# Altium schematic sheet MCH_FPGA_Bank_47_48_67_HP_VHDCI.SchDoc: Metlino
size 420 x 297 mm; CheckedBy: P.Kulik,T.Przywozki,W.Ruclo; Author: G.Kasprowicz; CompanyName: WUT ISE; DrawnBy: G.Kasprowicz; Organization: WUT ISE; Address1: PW ISE; Address2: Nowowiejska 15/19 00-665 Warsaw; Address3: gkasprow@gmail.com; DocumentNumber: 7; Revision: 2; SheetNumber: 7; SheetTotal: 29; ModifiedBy: -; CheckedDate: -; Title2: FPGA banks - VHDCI; DivGrp: WUT ISE; Designer: G.Kasprowicz; ModifiedDate: -; ProjectName: Sensor Box
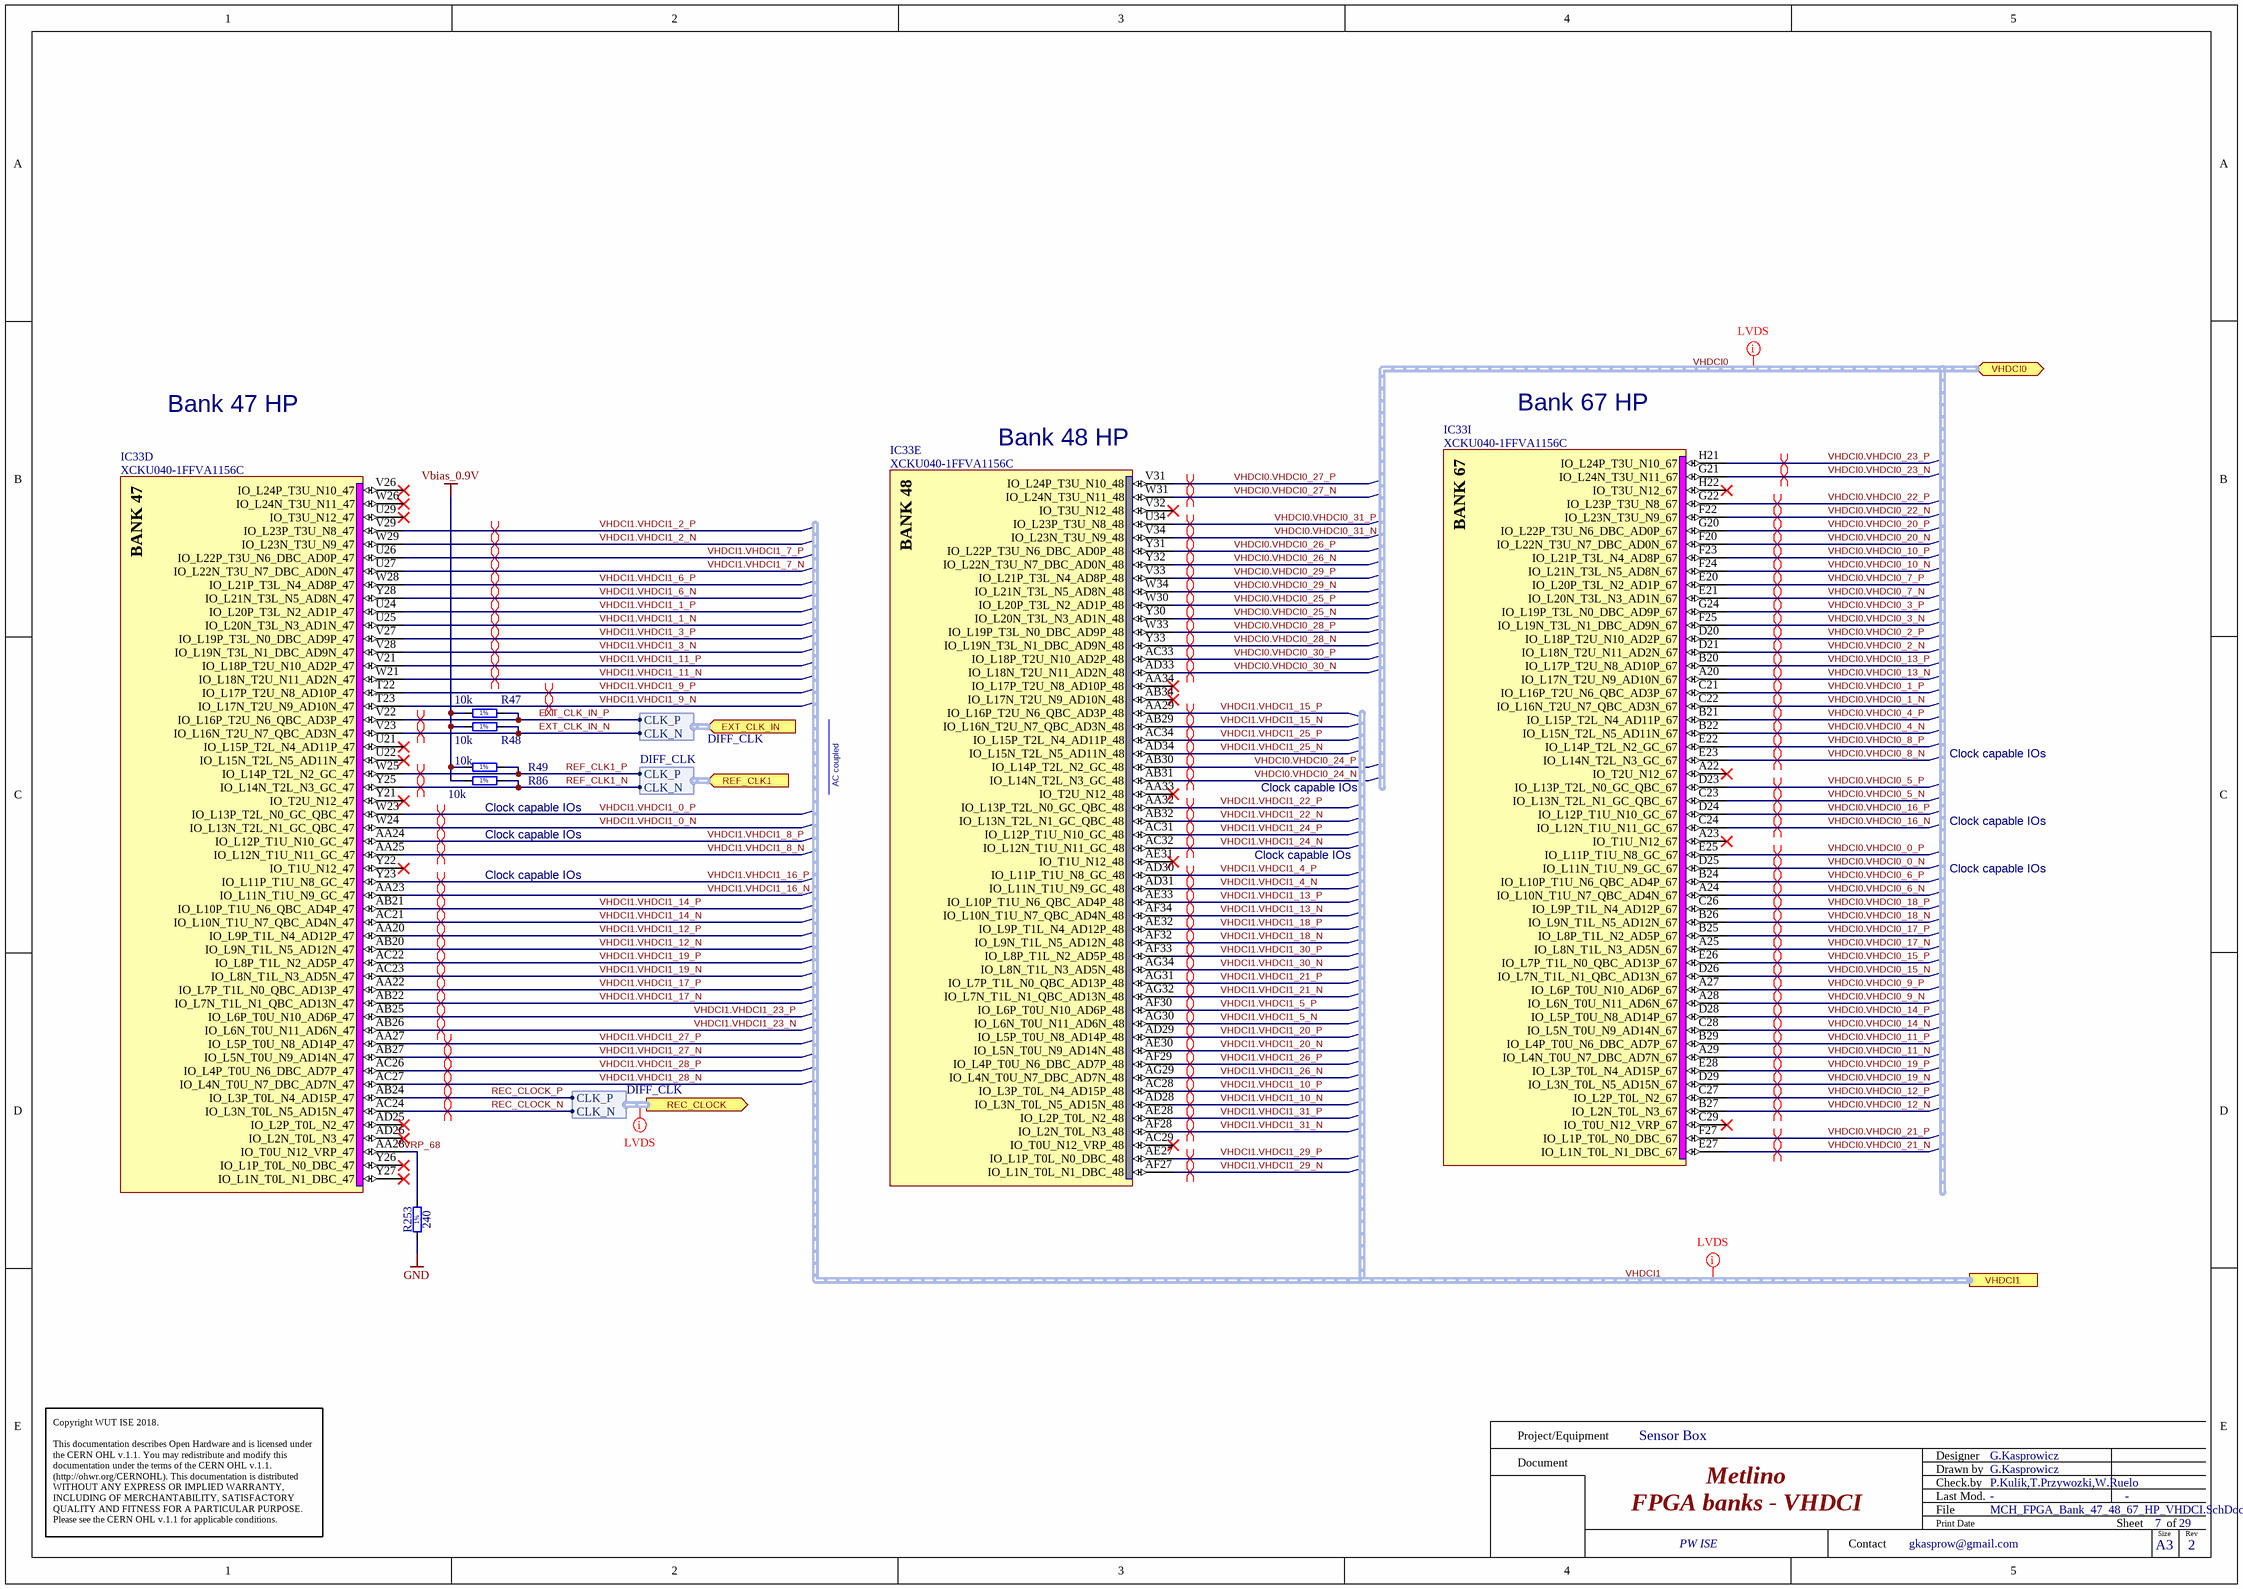
[diagram p0: MCH_FPGA_Bank_47_48_67_HP_VHDCI.SchDoc]

## Parts
IC33  XCKU040-1FFVA1156C  [BGA1156C100P34X34_3500X3500X350]  (parts D,E,I of 22)
R47  10k  [RESC1005X40N]
R48  10k  [RESC1005X40N]
R49  10k  [RESC1005X40N]
R86  10k  [RESC1005X40N]
R253  240  [RESC1005X40N]

## Ports
EXT_CLK_IN (in, harness DIFF_CLK), REC_CLOCK (out, harness DIFF_CLK), REF_CLK1 (in, harness DIFF_CLK), VHDCI0 (bidir, harness VHDCI0), VHDCI1 (harness VHDCI1)

## Harnesses
DIFF_CLK: CLK_N, CLK_P

## Nets
GND: R253.1
Vbias_0.9V: R47.1 R48.1 R49.1 R86.1
EXT_CLK_IN_N: IC33.V23(IO_L16N_T2U_N7_QBC_AD3N_47) R48.2 ; port EXT_CLK_IN.CLK_N
EXT_CLK_IN_P: IC33.V22(IO_L16P_T2U_N6_QBC_AD3P_47) R47.2 ; port EXT_CLK_IN.CLK_P
REC_CLOCK_N: IC33.AC24(IO_L3N_T0L_N5_AD15N_47) ; port REC_CLOCK.CLK_N
REC_CLOCK_P: IC33.AB24(IO_L3P_T0L_N4_AD15P_47) ; port REC_CLOCK.CLK_P
REF_CLK1_N: IC33.Y25(IO_L14N_T2L_N3_GC_47) R86.2 ; port REF_CLK1.CLK_N
REF_CLK1_P: IC33.W25(IO_L14P_T2L_N2_GC_47) R49.2 ; port REF_CLK1.CLK_P
VHDCI0.VHDCI0_0_N: IC33.D25(IO_L11N_T1U_N9_GC_67)
VHDCI0.VHDCI0_0_P: IC33.E25(IO_L11P_T1U_N8_GC_67)
VHDCI0.VHDCI0_1_N: IC33.C22(IO_L16N_T2U_N7_QBC_AD3N_67)
VHDCI0.VHDCI0_1_P: IC33.C21(IO_L16P_T2U_N6_QBC_AD3P_67)
VHDCI0.VHDCI0_2_N: IC33.D21(IO_L18N_T2U_N11_AD2N_67)
VHDCI0.VHDCI0_2_P: IC33.D20(IO_L18P_T2U_N10_AD2P_67)
VHDCI0.VHDCI0_3_N: IC33.F25(IO_L19N_T3L_N1_DBC_AD9N_67)
VHDCI0.VHDCI0_3_P: IC33.G24(IO_L19P_T3L_N0_DBC_AD9P_67)
VHDCI0.VHDCI0_4_N: IC33.B22(IO_L15N_T2L_N5_AD11N_67)
VHDCI0.VHDCI0_4_P: IC33.B21(IO_L15P_T2L_N4_AD11P_67)
VHDCI0.VHDCI0_5_N: IC33.C23(IO_L13N_T2L_N1_GC_QBC_67)
VHDCI0.VHDCI0_5_P: IC33.D23(IO_L13P_T2L_N0_GC_QBC_67)
VHDCI0.VHDCI0_6_N: IC33.A24(IO_L10N_T1U_N7_QBC_AD4N_67)
VHDCI0.VHDCI0_6_P: IC33.B24(IO_L10P_T1U_N6_QBC_AD4P_67)
VHDCI0.VHDCI0_7_N: IC33.E21(IO_L20N_T3L_N3_AD1N_67)
VHDCI0.VHDCI0_7_P: IC33.E20(IO_L20P_T3L_N2_AD1P_67)
VHDCI0.VHDCI0_8_N: IC33.E23(IO_L14N_T2L_N3_GC_67)
VHDCI0.VHDCI0_8_P: IC33.E22(IO_L14P_T2L_N2_GC_67)
VHDCI0.VHDCI0_9_N: IC33.A28(IO_L6N_T0U_N11_AD6N_67)
VHDCI0.VHDCI0_9_P: IC33.A27(IO_L6P_T0U_N10_AD6P_67)
VHDCI0.VHDCI0_10_N: IC33.F24(IO_L21N_T3L_N5_AD8N_67)
VHDCI0.VHDCI0_10_P: IC33.F23(IO_L21P_T3L_N4_AD8P_67)
VHDCI0.VHDCI0_11_N: IC33.A29(IO_L4N_T0U_N7_DBC_AD7N_67)
VHDCI0.VHDCI0_11_P: IC33.B29(IO_L4P_T0U_N6_DBC_AD7P_67)
VHDCI0.VHDCI0_12_N: IC33.B27(IO_L2N_T0L_N3_67)
VHDCI0.VHDCI0_12_P: IC33.C27(IO_L2P_T0L_N2_67)
VHDCI0.VHDCI0_13_N: IC33.A20(IO_L17N_T2U_N9_AD10N_67)
VHDCI0.VHDCI0_13_P: IC33.B20(IO_L17P_T2U_N8_AD10P_67)
VHDCI0.VHDCI0_14_N: IC33.C28(IO_L5N_T0U_N9_AD14N_67)
VHDCI0.VHDCI0_14_P: IC33.D28(IO_L5P_T0U_N8_AD14P_67)
VHDCI0.VHDCI0_15_N: IC33.D26(IO_L7N_T1L_N1_QBC_AD13N_67)
VHDCI0.VHDCI0_15_P: IC33.E26(IO_L7P_T1L_N0_QBC_AD13P_67)
VHDCI0.VHDCI0_16_N: IC33.C24(IO_L12N_T1U_N11_GC_67)
VHDCI0.VHDCI0_16_P: IC33.D24(IO_L12P_T1U_N10_GC_67)
VHDCI0.VHDCI0_17_N: IC33.A25(IO_L8N_T1L_N3_AD5N_67)
VHDCI0.VHDCI0_17_P: IC33.B25(IO_L8P_T1L_N2_AD5P_67)
VHDCI0.VHDCI0_18_N: IC33.B26(IO_L9N_T1L_N5_AD12N_67)
VHDCI0.VHDCI0_18_P: IC33.C26(IO_L9P_T1L_N4_AD12P_67)
VHDCI0.VHDCI0_19_N: IC33.D29(IO_L3N_T0L_N5_AD15N_67)
VHDCI0.VHDCI0_19_P: IC33.E28(IO_L3P_T0L_N4_AD15P_67)
VHDCI0.VHDCI0_20_N: IC33.F20(IO_L22N_T3U_N7_DBC_AD0N_67)
VHDCI0.VHDCI0_20_P: IC33.G20(IO_L22P_T3U_N6_DBC_AD0P_67)
VHDCI0.VHDCI0_21_N: IC33.E27(IO_L1N_T0L_N1_DBC_67)
VHDCI0.VHDCI0_21_P: IC33.F27(IO_L1P_T0L_N0_DBC_67)
VHDCI0.VHDCI0_22_N: IC33.F22(IO_L23N_T3U_N9_67)
VHDCI0.VHDCI0_22_P: IC33.G22(IO_L23P_T3U_N8_67)
VHDCI0.VHDCI0_23_N: IC33.G21(IO_L24N_T3U_N11_67)
VHDCI0.VHDCI0_23_P: IC33.H21(IO_L24P_T3U_N10_67)
VHDCI0.VHDCI0_24_N: IC33.AB31(IO_L14N_T2L_N3_GC_48)
VHDCI0.VHDCI0_24_P: IC33.AB30(IO_L14P_T2L_N2_GC_48)
VHDCI0.VHDCI0_25_N: IC33.Y30(IO_L20N_T3L_N3_AD1N_48)
VHDCI0.VHDCI0_25_P: IC33.W30(IO_L20P_T3L_N2_AD1P_48)
VHDCI0.VHDCI0_26_N: IC33.Y32(IO_L22N_T3U_N7_DBC_AD0N_48)
VHDCI0.VHDCI0_26_P: IC33.Y31(IO_L22P_T3U_N6_DBC_AD0P_48)
VHDCI0.VHDCI0_27_N: IC33.W31(IO_L24N_T3U_N11_48)
VHDCI0.VHDCI0_27_P: IC33.V31(IO_L24P_T3U_N10_48)
VHDCI0.VHDCI0_28_N: IC33.Y33(IO_L19N_T3L_N1_DBC_AD9N_48)
VHDCI0.VHDCI0_28_P: IC33.W33(IO_L19P_T3L_N0_DBC_AD9P_48)
VHDCI0.VHDCI0_29_N: IC33.W34(IO_L21N_T3L_N5_AD8N_48)
VHDCI0.VHDCI0_29_P: IC33.V33(IO_L21P_T3L_N4_AD8P_48)
VHDCI0.VHDCI0_30_N: IC33.AD33(IO_L18N_T2U_N11_AD2N_48)
VHDCI0.VHDCI0_30_P: IC33.AC33(IO_L18P_T2U_N10_AD2P_48)
VHDCI0.VHDCI0_31_N: IC33.V34(IO_L23N_T3U_N9_48)
VHDCI0.VHDCI0_31_P: IC33.U34(IO_L23P_T3U_N8_48)
VHDCI1.VHDCI1_0_N: IC33.W24(IO_L13N_T2L_N1_GC_QBC_47)
VHDCI1.VHDCI1_0_P: IC33.W23(IO_L13P_T2L_N0_GC_QBC_47)
VHDCI1.VHDCI1_1_N: IC33.U25(IO_L20N_T3L_N3_AD1N_47)
VHDCI1.VHDCI1_1_P: IC33.U24(IO_L20P_T3L_N2_AD1P_47)
VHDCI1.VHDCI1_2_N: IC33.W29(IO_L23N_T3U_N9_47)
VHDCI1.VHDCI1_2_P: IC33.V29(IO_L23P_T3U_N8_47)
VHDCI1.VHDCI1_3_N: IC33.V28(IO_L19N_T3L_N1_DBC_AD9N_47)
VHDCI1.VHDCI1_3_P: IC33.V27(IO_L19P_T3L_N0_DBC_AD9P_47)
VHDCI1.VHDCI1_4_N: IC33.AD31(IO_L11N_T1U_N9_GC_48)
VHDCI1.VHDCI1_4_P: IC33.AD30(IO_L11P_T1U_N8_GC_48)
VHDCI1.VHDCI1_5_N: IC33.AG30(IO_L6N_T0U_N11_AD6N_48)
VHDCI1.VHDCI1_5_P: IC33.AF30(IO_L6P_T0U_N10_AD6P_48)
VHDCI1.VHDCI1_6_N: IC33.Y28(IO_L21N_T3L_N5_AD8N_47)
VHDCI1.VHDCI1_6_P: IC33.W28(IO_L21P_T3L_N4_AD8P_47)
VHDCI1.VHDCI1_7_N: IC33.U27(IO_L22N_T3U_N7_DBC_AD0N_47)
VHDCI1.VHDCI1_7_P: IC33.U26(IO_L22P_T3U_N6_DBC_AD0P_47)
VHDCI1.VHDCI1_8_N: IC33.AA25(IO_L12N_T1U_N11_GC_47)
VHDCI1.VHDCI1_8_P: IC33.AA24(IO_L12P_T1U_N10_GC_47)
VHDCI1.VHDCI1_9_N: IC33.T23(IO_L17N_T2U_N9_AD10N_47)
VHDCI1.VHDCI1_9_P: IC33.T22(IO_L17P_T2U_N8_AD10P_47)
VHDCI1.VHDCI1_10_N: IC33.AD28(IO_L3N_T0L_N5_AD15N_48)
VHDCI1.VHDCI1_10_P: IC33.AC28(IO_L3P_T0L_N4_AD15P_48)
VHDCI1.VHDCI1_11_N: IC33.W21(IO_L18N_T2U_N11_AD2N_47)
VHDCI1.VHDCI1_11_P: IC33.V21(IO_L18P_T2U_N10_AD2P_47)
VHDCI1.VHDCI1_12_N: IC33.AB20(IO_L9N_T1L_N5_AD12N_47)
VHDCI1.VHDCI1_12_P: IC33.AA20(IO_L9P_T1L_N4_AD12P_47)
VHDCI1.VHDCI1_13_N: IC33.AF34(IO_L10N_T1U_N7_QBC_AD4N_48)
VHDCI1.VHDCI1_13_P: IC33.AE33(IO_L10P_T1U_N6_QBC_AD4P_48)
VHDCI1.VHDCI1_14_N: IC33.AC21(IO_L10N_T1U_N7_QBC_AD4N_47)
VHDCI1.VHDCI1_14_P: IC33.AB21(IO_L10P_T1U_N6_QBC_AD4P_47)
VHDCI1.VHDCI1_15_N: IC33.AB29(IO_L16N_T2U_N7_QBC_AD3N_48)
VHDCI1.VHDCI1_15_P: IC33.AA29(IO_L16P_T2U_N6_QBC_AD3P_48)
VHDCI1.VHDCI1_16_N: IC33.AA23(IO_L11N_T1U_N9_GC_47)
VHDCI1.VHDCI1_16_P: IC33.Y23(IO_L11P_T1U_N8_GC_47)
VHDCI1.VHDCI1_17_N: IC33.AB22(IO_L7N_T1L_N1_QBC_AD13N_47)
VHDCI1.VHDCI1_17_P: IC33.AA22(IO_L7P_T1L_N0_QBC_AD13P_47)
VHDCI1.VHDCI1_18_N: IC33.AF32(IO_L9N_T1L_N5_AD12N_48)
VHDCI1.VHDCI1_18_P: IC33.AE32(IO_L9P_T1L_N4_AD12P_48)
VHDCI1.VHDCI1_19_N: IC33.AC23(IO_L8N_T1L_N3_AD5N_47)
VHDCI1.VHDCI1_19_P: IC33.AC22(IO_L8P_T1L_N2_AD5P_47)
VHDCI1.VHDCI1_20_N: IC33.AE30(IO_L5N_T0U_N9_AD14N_48)
VHDCI1.VHDCI1_20_P: IC33.AD29(IO_L5P_T0U_N8_AD14P_48)
VHDCI1.VHDCI1_21_N: IC33.AG32(IO_L7N_T1L_N1_QBC_AD13N_48)
VHDCI1.VHDCI1_21_P: IC33.AG31(IO_L7P_T1L_N0_QBC_AD13P_48)
VHDCI1.VHDCI1_22_N: IC33.AB32(IO_L13N_T2L_N1_GC_QBC_48)
VHDCI1.VHDCI1_22_P: IC33.AA32(IO_L13P_T2L_N0_GC_QBC_48)
VHDCI1.VHDCI1_23_N: IC33.AB26(IO_L6N_T0U_N11_AD6N_47)
VHDCI1.VHDCI1_23_P: IC33.AB25(IO_L6P_T0U_N10_AD6P_47)
VHDCI1.VHDCI1_24_N: IC33.AC32(IO_L12N_T1U_N11_GC_48)
VHDCI1.VHDCI1_24_P: IC33.AC31(IO_L12P_T1U_N10_GC_48)
VHDCI1.VHDCI1_25_N: IC33.AD34(IO_L15N_T2L_N5_AD11N_48)
VHDCI1.VHDCI1_25_P: IC33.AC34(IO_L15P_T2L_N4_AD11P_48)
VHDCI1.VHDCI1_26_N: IC33.AG29(IO_L4N_T0U_N7_DBC_AD7N_48)
VHDCI1.VHDCI1_26_P: IC33.AF29(IO_L4P_T0U_N6_DBC_AD7P_48)
VHDCI1.VHDCI1_27_N: IC33.AB27(IO_L5N_T0U_N9_AD14N_47)
VHDCI1.VHDCI1_27_P: IC33.AA27(IO_L5P_T0U_N8_AD14P_47)
VHDCI1.VHDCI1_28_N: IC33.AC27(IO_L4N_T0U_N7_DBC_AD7N_47)
VHDCI1.VHDCI1_28_P: IC33.AC26(IO_L4P_T0U_N6_DBC_AD7P_47)
VHDCI1.VHDCI1_29_N: IC33.AF27(IO_L1N_T0L_N1_DBC_48)
VHDCI1.VHDCI1_29_P: IC33.AE27(IO_L1P_T0L_N0_DBC_48)
VHDCI1.VHDCI1_30_N: IC33.AG34(IO_L8N_T1L_N3_AD5N_48)
VHDCI1.VHDCI1_30_P: IC33.AF33(IO_L8P_T1L_N2_AD5P_48)
VHDCI1.VHDCI1_31_N: IC33.AF28(IO_L2N_T0L_N3_48)
VHDCI1.VHDCI1_31_P: IC33.AE28(IO_L2P_T0L_N2_48)
VRP_68: IC33.AA28(IO_T0U_N12_VRP_47) R253.2

Not connected (* = marked no-connect by the designer): IC33 A22(IO_T2U_N12_67)* A23(IO_T1U_N12_67)* AA33(IO_T2U_N12_48)* AA34(IO_L17P_T2U_N8_AD10P_48)* AB34(IO_L17N_T2U_N9_AD10N_48)* AC29(IO_T0U_N12_VRP_48)* AD25(IO_L2P_T0L_N2_47)* AD26(IO_L2N_T0L_N3_47)* AE31(IO_T1U_N12_48)* C29(IO_T0U_N12_VRP_67)* H22(IO_T3U_N12_67)* U21(IO_L15P_T2L_N4_AD11P_47)* U22(IO_L15N_T2L_N5_AD11N_47)* U29(IO_T3U_N12_47)* V26(IO_L24P_T3U_N10_47)* V32(IO_T3U_N12_48)* W26(IO_L24N_T3U_N11_47)* Y21(IO_T2U_N12_47)* Y22(IO_T1U_N12_47)* Y26(IO_L1P_T0L_N0_DBC_47)* Y27(IO_L1N_T0L_N1_DBC_47)*

## Buses and harness runs
harness VHDCI0 = port VHDCI0
harness VHDCI1 = port VHDCI1

## Layout directives
net class LVDS: (no net found under the mark)
differential pair: EXT_CLK_IN_N, EXT_CLK_IN_P, REC_CLOCK_N, REC_CLOCK_P, REF_CLK1_N, REF_CLK1_P, VHDCI0.VHDCI0_0_N, VHDCI0.VHDCI0_0_P, VHDCI0.VHDCI0_1_N, VHDCI0.VHDCI0_1_P, VHDCI0.VHDCI0_2_N, VHDCI0.VHDCI0_2_P, VHDCI0.VHDCI0_3_N, VHDCI0.VHDCI0_3_P, VHDCI0.VHDCI0_4_N, VHDCI0.VHDCI0_4_P, VHDCI0.VHDCI0_5_N, VHDCI0.VHDCI0_5_P, VHDCI0.VHDCI0_6_N, VHDCI0.VHDCI0_6_P, VHDCI0.VHDCI0_7_N, VHDCI0.VHDCI0_7_P, VHDCI0.VHDCI0_8_N, VHDCI0.VHDCI0_8_P, VHDCI0.VHDCI0_9_N, VHDCI0.VHDCI0_9_P, VHDCI0.VHDCI0_10_N, VHDCI0.VHDCI0_10_P, VHDCI0.VHDCI0_11_N, VHDCI0.VHDCI0_11_P, VHDCI0.VHDCI0_12_N, VHDCI0.VHDCI0_12_P, VHDCI0.VHDCI0_13_N, VHDCI0.VHDCI0_13_P, VHDCI0.VHDCI0_14_N, VHDCI0.VHDCI0_14_P, VHDCI0.VHDCI0_15_N, VHDCI0.VHDCI0_15_P, VHDCI0.VHDCI0_16_N, VHDCI0.VHDCI0_16_P, VHDCI0.VHDCI0_17_N, VHDCI0.VHDCI0_17_P, VHDCI0.VHDCI0_18_N, VHDCI0.VHDCI0_18_P, VHDCI0.VHDCI0_19_N, VHDCI0.VHDCI0_19_P, VHDCI0.VHDCI0_20_N, VHDCI0.VHDCI0_20_P, VHDCI0.VHDCI0_21_N, VHDCI0.VHDCI0_21_P, VHDCI0.VHDCI0_22_N, VHDCI0.VHDCI0_22_P, VHDCI0.VHDCI0_23_N, VHDCI0.VHDCI0_23_P, VHDCI0.VHDCI0_24_N, VHDCI0.VHDCI0_24_P, VHDCI0.VHDCI0_25_N, VHDCI0.VHDCI0_25_P, VHDCI0.VHDCI0_26_N, VHDCI0.VHDCI0_26_P, VHDCI0.VHDCI0_27_N, VHDCI0.VHDCI0_27_P, VHDCI0.VHDCI0_28_N, VHDCI0.VHDCI0_28_P, VHDCI0.VHDCI0_29_N, VHDCI0.VHDCI0_29_P, VHDCI0.VHDCI0_30_N, VHDCI0.VHDCI0_30_P, VHDCI0.VHDCI0_31_N, VHDCI0.VHDCI0_31_P, VHDCI1.VHDCI1_0_N, VHDCI1.VHDCI1_0_P, VHDCI1.VHDCI1_1_N, VHDCI1.VHDCI1_1_P, VHDCI1.VHDCI1_2_N, VHDCI1.VHDCI1_2_P, VHDCI1.VHDCI1_3_N, VHDCI1.VHDCI1_3_P, VHDCI1.VHDCI1_4_N, VHDCI1.VHDCI1_4_P, VHDCI1.VHDCI1_5_N, VHDCI1.VHDCI1_5_P, VHDCI1.VHDCI1_6_N, VHDCI1.VHDCI1_6_P, VHDCI1.VHDCI1_7_N, VHDCI1.VHDCI1_7_P, VHDCI1.VHDCI1_8_N, VHDCI1.VHDCI1_8_P, VHDCI1.VHDCI1_9_N, VHDCI1.VHDCI1_9_P, VHDCI1.VHDCI1_10_N, VHDCI1.VHDCI1_10_P, VHDCI1.VHDCI1_11_N, VHDCI1.VHDCI1_11_P, VHDCI1.VHDCI1_12_N, VHDCI1.VHDCI1_12_P, VHDCI1.VHDCI1_13_N, VHDCI1.VHDCI1_13_P, VHDCI1.VHDCI1_14_N, VHDCI1.VHDCI1_14_P, VHDCI1.VHDCI1_15_N, VHDCI1.VHDCI1_15_P, VHDCI1.VHDCI1_16_N, VHDCI1.VHDCI1_16_P, VHDCI1.VHDCI1_17_N, VHDCI1.VHDCI1_17_P, VHDCI1.VHDCI1_18_N, VHDCI1.VHDCI1_18_P, VHDCI1.VHDCI1_19_N, VHDCI1.VHDCI1_19_P, VHDCI1.VHDCI1_20_N, VHDCI1.VHDCI1_20_P, VHDCI1.VHDCI1_21_N, VHDCI1.VHDCI1_21_P, VHDCI1.VHDCI1_22_N, VHDCI1.VHDCI1_22_P, VHDCI1.VHDCI1_23_N, VHDCI1.VHDCI1_23_P, VHDCI1.VHDCI1_24_N, VHDCI1.VHDCI1_24_P, VHDCI1.VHDCI1_25_N, VHDCI1.VHDCI1_25_P, VHDCI1.VHDCI1_26_N, VHDCI1.VHDCI1_26_P, VHDCI1.VHDCI1_27_N, VHDCI1.VHDCI1_27_P, VHDCI1.VHDCI1_28_N, VHDCI1.VHDCI1_28_P, VHDCI1.VHDCI1_29_N, VHDCI1.VHDCI1_29_P, VHDCI1.VHDCI1_30_N, VHDCI1.VHDCI1_30_P, VHDCI1.VHDCI1_31_N, VHDCI1.VHDCI1_31_P

## Notes on the sheet
- Bank 47 HP
- Bank 67 HP
- (near IC33) Bank 48 HP
- Clock capable IOs
- AC coupled
- Project/Equipment
- Document
- Designer
- Drawn by
- Check.by
- Copyright WUT ISE 2018.
  This documentation describes Open Hardware and is licensed under the CERN OHL v.1.1. You may redistribute and modify this documentation under the terms of the CERN OHL v.1.1. (http://ohwr.org/CERNOHL). This documentation is distributed WITHOUT ANY EXPRESS OR IMPLIED WARRANTY, INCLUDING OF MERCHANTABILITY, SATISFACTORY QUALITY AND FITNESS FOR A PARTICULAR PURPOSE. Please see the CERN OHL v.1.1 for applicable conditions.
- Contact
- File
- Last Mod.
- Print Date
- Sheet
- Size
- A3
- of
- Rev
- (in symbol R0402_10K_1%_0.0625W_100PPM) 1%
- (in symbol R0402_240R_1%_0.0625W_100PPM) 1%
- (in symbol XCKU040-1FFVA1156C, part D) BANK 47
- (in symbol XCKU040-1FFVA1156C, part E) BANK 48
- (in symbol XCKU040-1FFVA1156C, part I) BANK 67

## Library data of the parts
IC33 = XCKU040-1FFVA1156C: Kintex UltraScale FPGA, 520 I/O, 530K Cells, 1156-Ball BGA, Speed Grade 1, Commercial Grade; Manufacturer: XILINX; Part Description: Kintex UltraScale, 40 DLL I/O, 416 HP I/O, 104 HR I/O, 1156-Pin BGA, Speed Grade 1, Commercial Grade; PressFit: No; Bonding: No; Manufacturer Part Number: XCKU040-1FFVA1156C; PackageDescription: BGA, 1.00mm Pitch, Square; 1156 Pin, 34 Columns X 34 Rows, Body 35.00mm X 35.00mm X 3.50mm H, IPC Medium Density; Part Number: XCKU040-1FFVA1156C; Component Kind: Standard; Component Type: Standard; Device: XCKU040-1FFVA1156C; Pin Count: 1156; Case: BGA1156; Mounted: Yes; Socket: No; SMD: Yes; Sense: No; ComponentHeight: 3.5mm; HelpURL: \\cern.ch\dfs\Applications\Altium\Datasheets\XCKU040-1FFVA1156C.pdf; ComponentLink1URL: \\cern.ch\dfs\Applications\Altium\Datasheets\XCKU040-1FFVA1156C_Package-Pinout.pdf; ComponentLink1Description: Package/Pinout; Author: CERN DEM CA; CreateDate: 16.08.2016; LatestRevisionDate: 16.08.2016
R47-R49 R86 = R0402_10K_1%_0.0625W_100PPM: Resistor - 1%; Manufacturer: GENERIC; Part Description: General Purpose Thick Film Chip Resistor; Manufacturer1 Part Number: 232270671003L; TC: ±100ppm/°C; PressFit: No; Manufacturer Part Number: R0402_10K_1%_0.0625W_100PPM; Part Number: R0402_10K_1%_0.0625W_100PPM; Tolerance: ±1%; Value: 10k; Component Kind: Standard; Component Type: Standard; Pin Count: 2; Status: Not Recommended; Power: 0.0625W; Case: 0402; Mounted: Yes; Sense: No; Socket: No; SMD: Yes; Manufacturer1 Example: YAGEO PHYCOMP; Manufacturer1 ComponentHeight: 0.4mm; HelpURL: \\cern.ch\dfs\Applications\Altium\Datasheets\R0402_Phycomp_RC0402.pdf; Author: CERN DEM JLC; CreateDate: 03.12.2007; LatestRevisionDate: 17.10.2012
R253 = R0402_240R_1%_0.0625W_100PPM: Resistor - 1%; Manufacturer: GENERIC; Part Description: General Purpose Thick Film Chip Resistor; Manufacturer1 Part Number: 232270672401L; TC: ±100ppm/°C; PressFit: No; Manufacturer Part Number: R0402_240R_1%_0.0625W_100PPM; Part Number: R0402_240R_1%_0.0625W_100PPM; Tolerance: ±1%; Value: 240; Component Kind: Standard; Component Type: Standard; Pin Count: 2; Status: Not Recommended; Power: 0.0625W; Case: 0402; Mounted: Yes; Sense: No; Socket: No; SMD: Yes; Manufacturer1 Example: YAGEO PHYCOMP; Manufacturer1 ComponentHeight: 0.4mm; HelpURL: \\cern.ch\dfs\Applications\Altium\Datasheets\R0402_Phycomp_RC0402.pdf; Author: CERN DEM JLC; CreateDate: 03.12.2007; LatestRevisionDate: 17.10.2012